# Altium schematic sheet Driver.SchDoc: 2/2
size A4
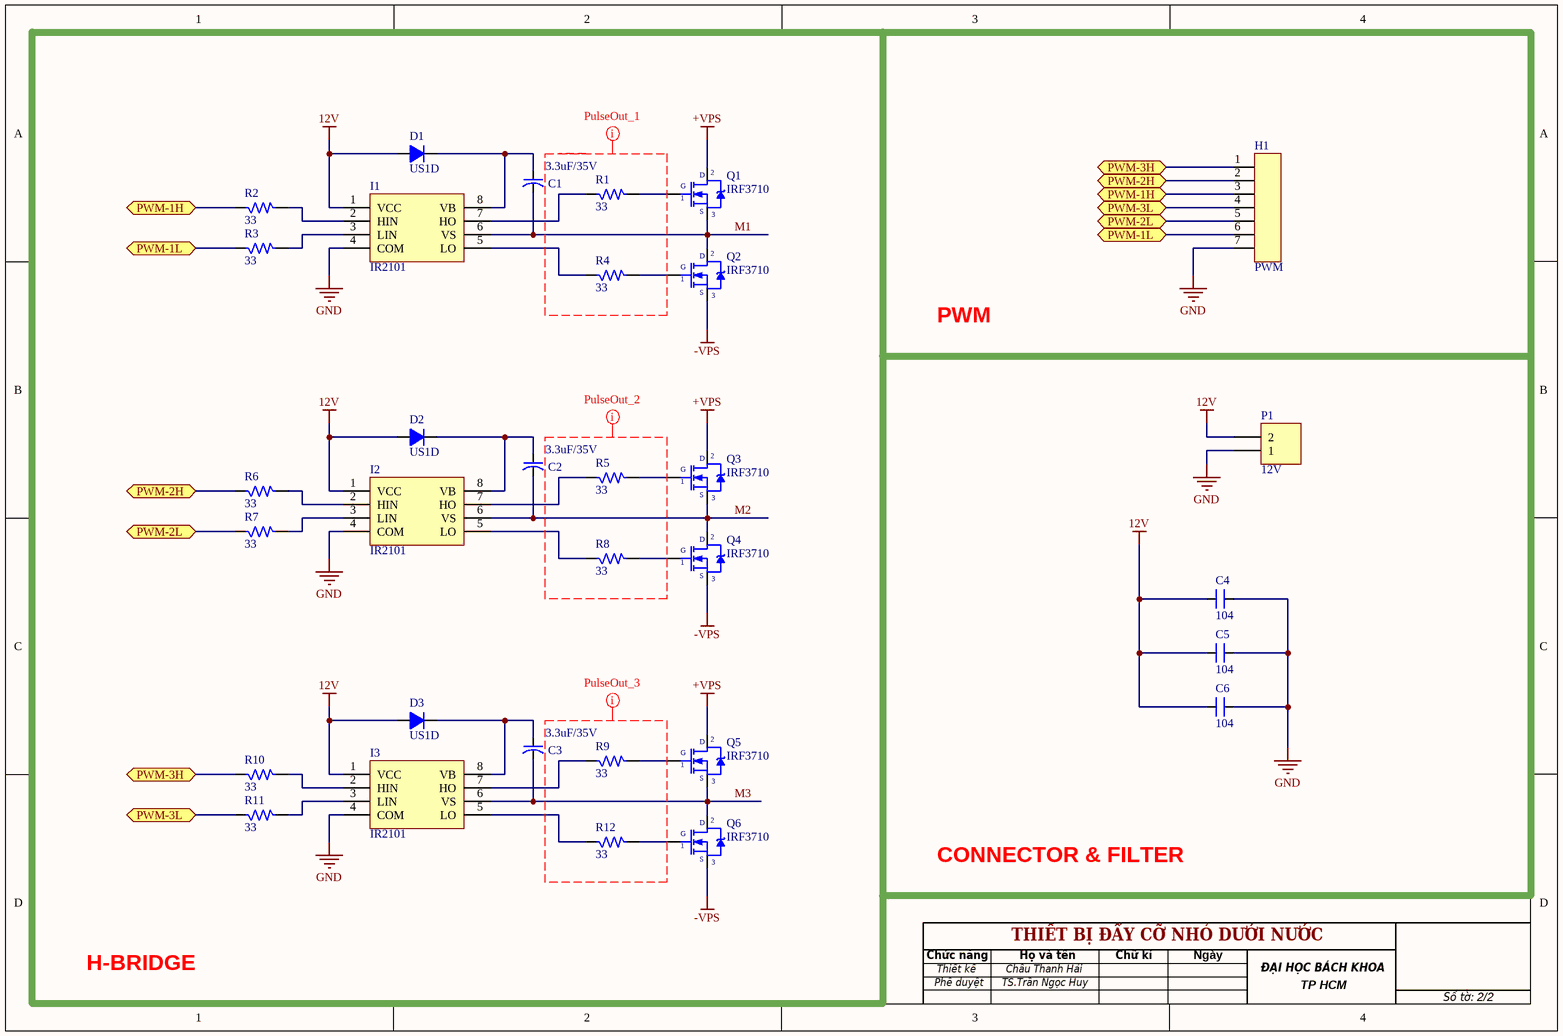
[diagram p0: Driver.SchDoc]

## Parts
C1  3.3uF/35V  [3.3uF/35V Bootstrap]
C2  3.3uF/35V  [3.3uF/35V Bootstrap]
C3  3.3uF/35V  [3.3uF/35V Bootstrap]
C4  104  [Non-Capacitor 104 SMD]
C5  104  [Non-Capacitor 104 SMD]
C6  104  [Non-Capacitor 104 SMD]
D1  US1D  [US1D]
D2  US1D  [US1D]
D3  US1D  [US1D]
H1  PWM  [Header 7 Male]
I1  IR2101  [IR2101S]
I2  IR2101  [IR2101S]
I3  IR2101  [IR2101S]
P1  12V  [HDR1X2]
Q1  IRF3710  [IRF3710]
Q2  IRF3710  [IRF3710]
Q3  IRF3710  [IRF3710]
Q4  IRF3710  [IRF3710]
Q5  IRF3710  [IRF3710]
Q6  IRF3710  [IRF3710]
R1  33  [Resistor SMD 0603]
R2  33  [Resistor SMD 0603]
R3  33  [Resistor SMD 0603]
R4  33  [Resistor SMD 0603]
R5  33  [Resistor SMD 0603]
R6  33  [Resistor SMD 0603]
R7  33  [Resistor SMD 0603]
R8  33  [Resistor SMD 0603]
R9  33  [Resistor SMD 0603]
R10  33  [Resistor SMD 0603]
R11  33  [Resistor SMD 0603]
R12  33  [Resistor SMD 0603]

## Blocks framed on the sheet
H-BRIDGE: C1-C3 D1-D3 I1-I3 Q1-Q6 R1-R12

## Ports
PWM-1H (bidir), PWM-1L (bidir), PWM-2H (bidir), PWM-2L (bidir), PWM-3H (bidir), PWM-3L (bidir)

## Nets
12V: C4.1 C5.1 C6.1 D1.2(A) D2.2(A) D3.2(A) I1.1(VCC) I2.1(VCC) I3.1(VCC) P1.2
+VPS: Q1.2(D) Q3.2(D) Q5.2(D)
-VPS: Q2.3(S) Q4.3(S) Q6.3(S)
GND: C4.2 C5.2 C6.2 H1.7 I1.4(COM) I2.4(COM) I3.4(COM) P1.1
M1: C1.2 I1.6(VS) Q1.3(S) Q2.2(D)
M2: C2.2 I2.6(VS) Q3.3(S) Q4.2(D)
M3: C3.2 I3.6(VS) Q5.3(S) Q6.2(D)
PWM-1H: H1.3 R2.1 ; port PWM-1H
PWM-1L: H1.6 R3.1 ; port PWM-1L
PWM-2H: H1.2 R6.1 ; port PWM-2H
PWM-2L: H1.5 R7.1 ; port PWM-2L
PWM-3H: H1.1 R10.1 ; port PWM-3H
PWM-3L: H1.4 R11.1 ; port PWM-3L
NetC1_1: C1.1 D1.1(K) I1.8(VB)
NetC2_1: C2.1 D2.1(K) I2.8(VB)
NetC3_1: C3.1 D3.1(K) I3.8(VB)
NetI1_2: I1.2(HIN) R2.2
NetI1_3: I1.3(LIN) R3.2
NetI1_5: I1.5(LO) R4.1
NetI1_7: I1.7(HO) R1.1
NetI2_2: I2.2(HIN) R6.2
NetI2_3: I2.3(LIN) R7.2
NetI2_5: I2.5(LO) R8.1
NetI2_7: I2.7(HO) R5.1
NetI3_2: I3.2(HIN) R10.2
NetI3_3: I3.3(LIN) R11.2
NetI3_5: I3.5(LO) R12.1
NetI3_7: I3.7(HO) R9.1
NetQ1_1: Q1.1(G) R1.2
NetQ2_1: Q2.1(G) R4.2
NetQ3_1: Q3.1(G) R5.2
NetQ4_1: Q4.1(G) R8.2
NetQ5_1: Q5.1(G) R9.2
NetQ6_1: Q6.1(G) R12.2

## Layout directives
mark named PulseOut_1: (no net found under the mark)
mark named PulseOut_3: (no net found under the mark)
mark named PulseOut_2: (no net found under the mark)

## Notes on the sheet
- PWM
- CONNECTOR & FILTER
- Chức năng
- Phê duyệt
- Thiết kế
- TS.Trần Ngọc Huy
- Châu Thanh Hải
- THIẾT BỊ ĐẨY CỠ NHỎ DƯỚI NƯỚC
- Họ và tên
- Chữ kí
- Ngày
- ĐẠI HỌC BÁCH KHOA
- TP HCM
- Số tờ:

## Library data of the parts
H1 = Header 7x1
P1 = Header 2: Header, 2-Pin; LatestRevisionDate: 17-Jul-2002; LatestRevisionNote: Re-released for DXP Platform.; Publisher: Altium Limited
R1-R12 = Resistors